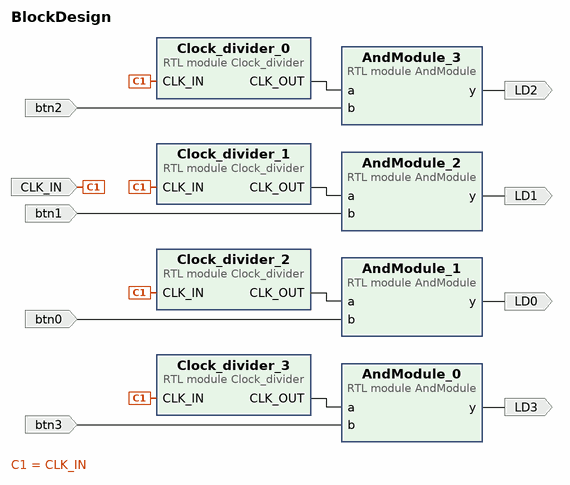
[diagram p0: block diagram of the top level]
# Vivado block design BlockDesign, xc7z020clg400-1, Vivado 2022.1
create_bd_design BlockDesign

create_bd_port -dir I -type clk CLK_IN
set_property -dict {CONFIG.FREQ_HZ 125000000} [get_bd_ports CLK_IN]
create_bd_port -dir I btn0
create_bd_port -dir I btn1
create_bd_port -dir I btn2
create_bd_port -dir I btn3
create_bd_port -dir O LD0
create_bd_port -dir O LD1
create_bd_port -dir O LD2
create_bd_port -dir O LD3

create_bd_cell -type module -reference Clock_divider Clock_divider_0
set_property -dict {CONFIG.DIVISOR 0x1dcd650} [get_bd_cells Clock_divider_0]
create_bd_cell -type module -reference Clock_divider Clock_divider_1
set_property -dict {CONFIG.DIVISOR 0x3b9aca0} [get_bd_cells Clock_divider_1]
create_bd_cell -type module -reference Clock_divider Clock_divider_2
set_property -dict {CONFIG.DIVISOR 0x7735940} [get_bd_cells Clock_divider_2]
create_bd_cell -type module -reference Clock_divider Clock_divider_3
set_property -dict {CONFIG.DIVISOR 0x0ee6b28} [get_bd_cells Clock_divider_3]
create_bd_cell -type module -reference AndModule AndModule_0
create_bd_cell -type module -reference AndModule AndModule_1
create_bd_cell -type module -reference AndModule AndModule_2
create_bd_cell -type module -reference AndModule AndModule_3

# ---- connections ----

connect_bd_net [get_bd_pins AndModule_0/y] [get_bd_ports LD3]
connect_bd_net [get_bd_pins AndModule_1/y] [get_bd_ports LD0]
connect_bd_net [get_bd_pins AndModule_2/y] [get_bd_ports LD1]
connect_bd_net [get_bd_pins AndModule_3/y] [get_bd_ports LD2]
connect_bd_net [get_bd_ports CLK_IN] \
  [get_bd_pins Clock_divider_3/CLK_IN] [get_bd_pins Clock_divider_2/CLK_IN] [get_bd_pins Clock_divider_1/CLK_IN] \
  [get_bd_pins Clock_divider_0/CLK_IN]
connect_bd_net [get_bd_pins Clock_divider_0/CLK_OUT] [get_bd_pins AndModule_3/a]
connect_bd_net [get_bd_pins Clock_divider_1/CLK_OUT] [get_bd_pins AndModule_2/a]
connect_bd_net [get_bd_pins Clock_divider_2/CLK_OUT] [get_bd_pins AndModule_1/a]
connect_bd_net [get_bd_pins Clock_divider_3/CLK_OUT] [get_bd_pins AndModule_0/a]
connect_bd_net -net btn0_1 [get_bd_ports btn0] [get_bd_pins AndModule_1/b]
connect_bd_net -net btn1_1 [get_bd_ports btn1] [get_bd_pins AndModule_2/b]
connect_bd_net -net btn2_1 [get_bd_ports btn2] [get_bd_pins AndModule_3/b]
connect_bd_net -net btn3_1 [get_bd_ports btn3] [get_bd_pins AndModule_0/b]

validate_bd_design
save_bd_design
